# Altium project 程控放大衰减电路.PrjPCB
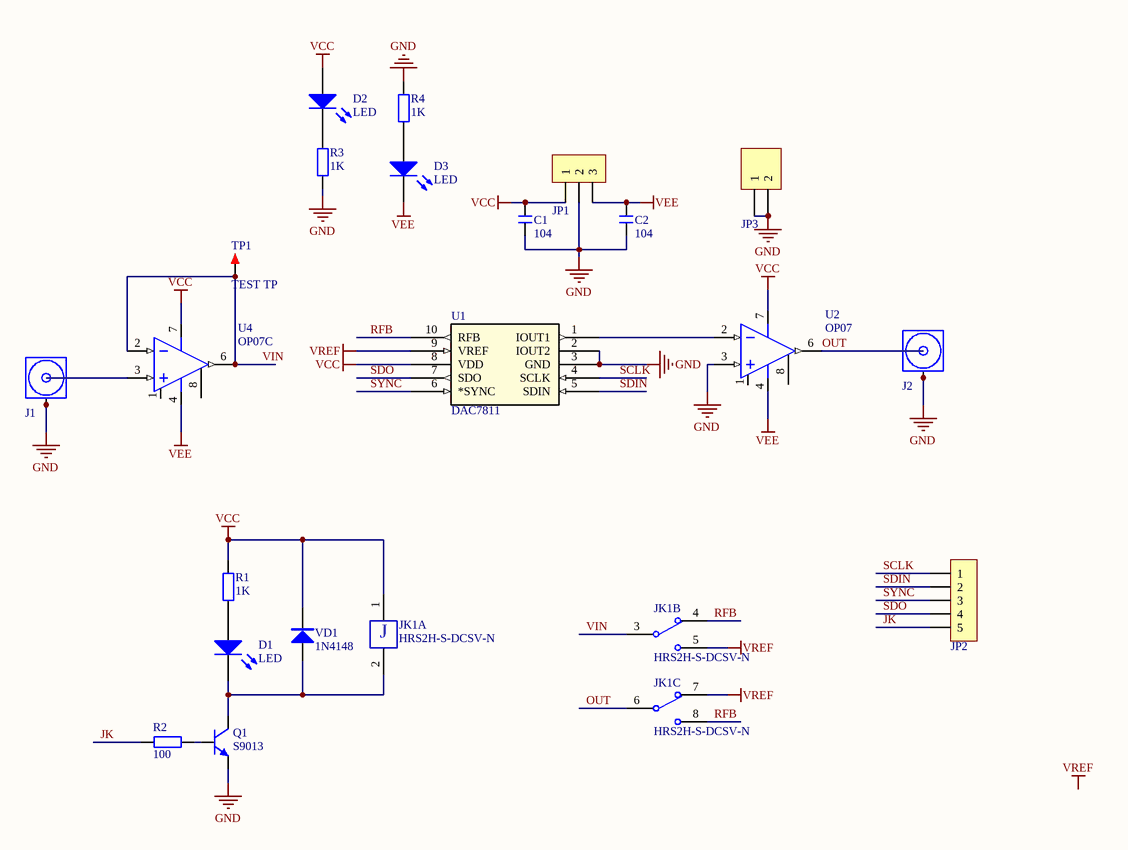
[diagram p0: 程控放大衰减电路.SchDoc]
1 sheet, 21 parts. Net scope: global (net labels, ports and power ports of the same name join across sheets).
Board file: 程控放大衰减电路.PcbDoc

## Sheet 程控放大衰减电路.SchDoc
size A4

### Parts
C1  104  [C 0805]
C2  104  [C 0805]
D1  LED  [LED_0805]
D2  LED  [LED_0805]
D3  LED  [LED_0805]
J1  COAX  [MCX5.08-5-H]  (value not drawn)
J2  COAX  [MCX5.08-5-H]  (value not drawn)
JK1  HRS2H-S-DCSV-N  [HRS2H]  (parts A,B,C of 3)
JP1  HDR-1X3  [HDR-1X3]  (value not drawn)
JP2  HDR-1X5  [HDR-1X5]  (value not drawn)
JP3  Header 2  [HDR2X1_A]  (value not drawn)
Q1  S9013  [SOT23-3N]
R1  1K  [R 0805]
R2  100  [R 0805]
R3  1K  [R 0805]
R4  1K  [R 0805]
TP1  TEST TP  [TEST TP1.4_B]
U1  DAC7811  [VSSOP 10 (DGK)]
U2  OP07  [SO8_L]
U4  OP07C  [SO8_L]
VD1  1N4148  [SOD-323]

### Nets
GND: C1.1 C2.1 J1.2(GND) J1.3(GND) J1.4(GND) J1.5(GND) J2.2(GND) J2.3(GND) J2.4(GND) J2.5(GND) JP1.2 JP3.1 JP3.2 Q1.2(E) R3.1 R4.2 U1.2(IOUT2) U1.3(GND) U2.3(IN+)
VCC: C1.2 D2.1(A) JK1.1 JP1.1 R1.2 U1.8(VDD) U2.7(V+) U4.7(V+) VD1.2(K)
VEE: C2.2 D3.2(K) JP1.3 U2.4(V-) U4.4(V-)
VREF: JK1.5 JK1.7 U1.9(VREF)
JK: JP2.5 R2.1
OUT: J2.1(Signal) JK1.6 U2.6(OUT)
RFB: JK1.4 JK1.8 U1.10(RFB)
SCLK: JP2.1 U1.4(SCLK)
SDIN: JP2.2 U1.5(SDIN)
SDO: JP2.4 U1.7(SDO)
SYNC: JP2.3 U1.6(*SYNC)
VIN: JK1.3 TP1.1 U4.2(IN-) U4.6(OUT)
NetD1_1: D1.1(A) R1.1
NetD1_2: D1.2(K) JK1.2 Q1.3(C) VD1.1(A)
NetD2_2: D2.2(K) R3.2
NetD3_1: D3.1(A) R4.1
NetJ1_1: J1.1(Signal) U4.3(IN+)
NetQ1_1: Q1.1(B) R2.2
NetU1_1: U1.1(IOUT1) U2.2(IN-)

Not connected (* = marked no-connect by the designer): U2 1(OFFSET_N1) 8(OFFSET_N2); U4 1(OFFSET_N1) 8(OFFSET_N2)

### Notes on the sheet
- Labels drawn without touching a wire or pin: VREF
- (in symbol HRS2H-S-DCSV-N_X, part A) J

### Library data of the parts
C1 C2 = C: 无极性贴片电容; 版权归属: 源创客; BOM名称: 无极性贴片电容; 学习资源: www.ooocke.com
D1-D3 = LED: 发光二极管; Published: 8-Jun-2000; LatestRevisionDate: 08-Jul-2005; LatestRevisionNote: Mech Layer 1 removed.; PackageReference: LED; Publisher: Altium Limited
JK1 = HRS2H-S-DCSV-N_X: 5V双路双控继电器; BOM名称: 5V双路继电器; 版权归属: 源创客; 学习资源: www.ooocke.com
JP1 = Header 3: 3P接插件; 版权归属: 源创客; BOM名称: 3P接插件; 学习资源: www.ooocke.com
JP2 = Header 5: 5P接插件; 版权归属: 源创客; BOM名称: 5P接插件; 学习资源: www.ooocke.com
JP3 = Header 2: 接插件; LatestRevisionDate: 17-Jul-2002; LatestRevisionNote: Re-released for DXP Platform.; Publisher: Altium Limited
Q1 = 9013-SMD: 低频放大-NPN型; 版权归属: 源创客; 属性: 50V 0.5A 0.625W; BOM名称: 低频放大-NPN型; 学习资源: www.ooocke.com
R1-R4 = R: 贴片电阻; 版权归属: 源创客; BOM名称: 贴片电阻; 学习资源: www.ooocke.com
TP1 = TEST TP: 测试环; 版权归属: 源创客; BOM名称: 测试环; 学习资源: www.ooocke.com
U1 = DAC7811: 12-Bit, Serial Input, Multiplying Digital-to-Analog Converter; Manufacturer: Texas Instruments; Manufacturer_Part_Number: dac7811_dgs_10; INDUSTRY_STD_PKG_TYPE: MSOP; FAMILY_NAME: PRECISION DAC (=<10MSPS); PIN_COUNT: 10; PACKAGE_DESIGNATOR: DGS; Datasheet URL: http://www.ti.com/lit/gpn/DAC7811; GENERIC_PART_NUMBER: DAC7811; Vendor: Texas Instruments; RefDes: RefDes; Type: DEV; Value: Value
U2 U4 = OP07: Precision Operational Amplifiers
VD1 = 1N4148: 高速开关二极管; 版权归属: 源创客; BOM名称: 高速开关二极管; 学习资源: www.ooocke.com